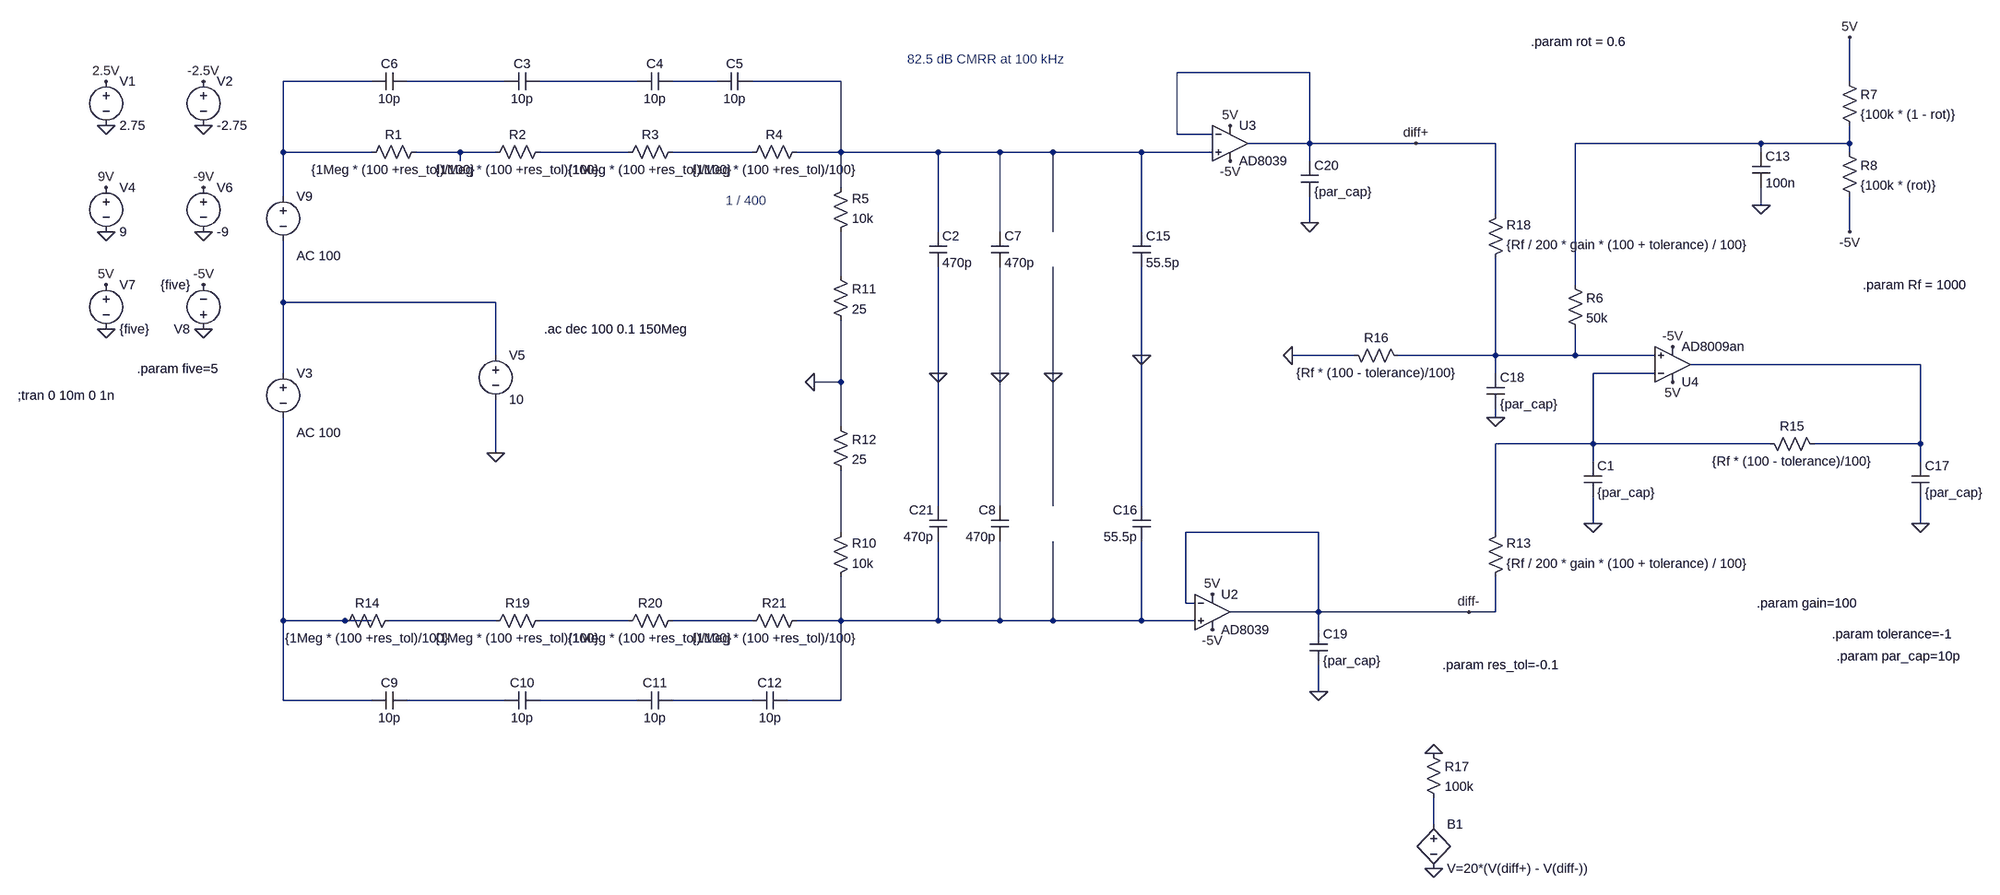
[diagram p0: schematic ac_analysis_dc_offset.asc]
ac_analysis_dc_offset.asc, the LTspice schematic file:
Version 4
SHEET 1 3776 1588
WIRE 2096 -272 1856 -272
WIRE 400 -256 240 -256
WIRE 640 -256 464 -256
WIRE 880 -256 704 -256
WIRE 1024 -256 944 -256
WIRE 1248 -256 1088 -256
WIRE 3072 -256 3072 -336
WIRE 1856 -160 1856 -272
WIRE 1920 -160 1856 -160
WIRE 2096 -144 2096 -272
WIRE 2096 -144 1984 -144
WIRE 2288 -144 2096 -144
WIRE 2432 -144 2288 -144
WIRE 2912 -144 2576 -144
WIRE 3072 -144 3072 -176
WIRE 3072 -144 2912 -144
WIRE 240 -128 240 -256
WIRE 400 -128 240 -128
WIRE 560 -128 480 -128
WIRE 624 -128 560 -128
WIRE 864 -128 704 -128
WIRE 1088 -128 944 -128
WIRE 1248 -128 1248 -256
WIRE 1248 -128 1168 -128
WIRE 1424 -128 1248 -128
WIRE 1536 -128 1424 -128
WIRE 1632 -128 1536 -128
WIRE 1792 -128 1632 -128
WIRE 1920 -128 1792 -128
WIRE 2912 -128 2912 -144
WIRE 3072 -128 3072 -144
WIRE 560 -112 560 -128
WIRE 2096 -112 2096 -144
WIRE 1248 -64 1248 -128
WIRE 240 -48 240 -128
WIRE 2912 -32 2912 -64
WIRE 2432 -16 2432 -144
WIRE 2096 0 2096 -48
WIRE 1424 16 1424 -128
WIRE 1536 16 1536 -128
WIRE 1632 16 1632 -128
WIRE 1792 16 1792 -128
WIRE 3072 16 3072 -48
WIRE 1248 96 1248 16
WIRE 2576 112 2576 -144
WIRE 240 144 240 32
WIRE 624 144 240 144
WIRE 624 240 624 144
WIRE 1792 240 1792 80
WIRE 2176 240 2064 240
WIRE 2432 240 2432 64
WIRE 2432 240 2256 240
WIRE 2576 240 2576 192
WIRE 2576 240 2432 240
WIRE 2720 240 2576 240
WIRE 3200 256 2784 256
WIRE 240 272 240 144
WIRE 1424 272 1424 80
WIRE 1536 272 1536 80
WIRE 1632 272 1632 80
WIRE 2432 272 2432 240
WIRE 2720 272 2608 272
WIRE 1248 288 1248 176
WIRE 1248 288 1200 288
WIRE 2432 352 2432 336
WIRE 1248 368 1248 288
WIRE 2608 400 2608 272
WIRE 2608 400 2432 400
WIRE 2928 400 2608 400
WIRE 3200 400 3200 256
WIRE 3200 400 3008 400
WIRE 624 416 624 320
WIRE 2608 432 2608 400
WIRE 3200 432 3200 400
WIRE 1424 512 1424 272
WIRE 1536 512 1536 272
WIRE 1632 512 1632 272
WIRE 1792 512 1792 240
WIRE 2608 544 2608 496
WIRE 3200 544 3200 496
WIRE 1248 560 1248 448
WIRE 2112 560 1872 560
WIRE 2432 560 2432 400
WIRE 1872 688 1872 560
WIRE 1888 688 1872 688
WIRE 2112 704 2112 560
WIRE 2112 704 1952 704
WIRE 2384 704 2112 704
WIRE 2432 704 2432 640
WIRE 2432 704 2384 704
WIRE 240 720 240 352
WIRE 352 720 240 720
WIRE 400 720 352 720
WIRE 624 720 432 720
WIRE 864 720 704 720
WIRE 1088 720 944 720
WIRE 1248 720 1248 640
WIRE 1248 720 1168 720
WIRE 1424 720 1424 576
WIRE 1424 720 1248 720
WIRE 1536 720 1536 576
WIRE 1536 720 1424 720
WIRE 1632 720 1632 576
WIRE 1632 720 1536 720
WIRE 1792 720 1792 576
WIRE 1792 720 1632 720
WIRE 1888 720 1792 720
WIRE 2112 736 2112 704
WIRE 2112 848 2112 800
WIRE 240 864 240 720
WIRE 400 864 240 864
WIRE 640 864 464 864
WIRE 880 864 704 864
WIRE 1088 864 944 864
WIRE 1248 864 1248 720
WIRE 1248 864 1152 864
WIRE 2320 1088 2320 1040
FLAG -80 -176 0
FLAG -80 -256 2.5V
FLAG 96 -176 0
FLAG 96 -256 -2.5V
FLAG 1200 288 0
FLAG 1632 272 0
FLAG 1792 240 0
FLAG 1952 -176 5V
FLAG 1952 -112 -5V
FLAG 624 416 0
FLAG 1536 272 0
FLAG -80 16 0
FLAG -80 -64 9V
FLAG 96 16 0
FLAG 96 -64 -9V
FLAG 2064 240 0
FLAG -80 192 0
FLAG -80 112 5V
FLAG 96 192 0
FLAG 1920 672 5V
FLAG 1920 736 -5V
FLAG 2752 288 5V
FLAG 2752 224 -5V
FLAG 96 112 -5V
FLAG 2288 -144 diff+
FLAG 2384 704 diff-
FLAG 2320 1168 0
FLAG 2320 960 0
FLAG 2432 352 0
FLAG 2608 544 0
FLAG 3200 544 0
FLAG 1424 272 0
FLAG 2112 848 0
FLAG 2096 0 0
FLAG 2912 -32 0
FLAG 3072 -336 5V
FLAG 3072 16 -5V
SYMBOL voltage -80 -272 R0
SYMATTR InstName V1
SYMATTR Value 2.75
SYMBOL voltage 96 -272 R0
SYMATTR InstName V2
SYMATTR Value -2.75
SYMBOL voltage 240 256 R0
WINDOW 123 24 124 Left 2
WINDOW 39 0 0 Left 0
SYMATTR Value2 AC 100
SYMATTR InstName V3
SYMATTR Value ""
SYMBOL res 496 -144 R90
WINDOW 0 0 56 VBottom 2
WINDOW 3 32 56 VTop 2
SYMATTR InstName R1
SYMATTR Value {1Meg * (100 +res_tol)/100}
SYMBOL res 1232 656 M180
WINDOW 0 36 76 Left 2
WINDOW 3 36 40 Left 2
SYMATTR InstName R10
SYMATTR Value 10k
SYMBOL cap 464 -272 R90
WINDOW 0 0 32 VBottom 2
WINDOW 3 32 32 VTop 2
SYMATTR InstName C6
SYMATTR Value 10p
SYMBOL cap 704 -272 R90
WINDOW 0 0 32 VBottom 2
WINDOW 3 32 32 VTop 2
SYMATTR InstName C3
SYMATTR Value 10p
SYMBOL cap 944 -272 R90
WINDOW 0 0 32 VBottom 2
WINDOW 3 32 32 VTop 2
SYMATTR InstName C4
SYMATTR Value 10p
SYMBOL cap 1088 -272 R90
WINDOW 0 0 32 VBottom 2
WINDOW 3 32 32 VTop 2
SYMATTR InstName C5
SYMATTR Value 10p
SYMBOL cap 464 848 R90
WINDOW 0 0 32 VBottom 2
WINDOW 3 32 32 VTop 2
SYMATTR InstName C9
SYMATTR Value 10p
SYMBOL cap 704 848 R90
WINDOW 0 0 32 VBottom 2
WINDOW 3 32 32 VTop 2
SYMATTR InstName C10
SYMATTR Value 10p
SYMBOL cap 944 848 R90
WINDOW 0 0 32 VBottom 2
WINDOW 3 32 32 VTop 2
SYMATTR InstName C11
SYMATTR Value 10p
SYMBOL cap 1152 848 R90
WINDOW 0 0 32 VBottom 2
WINDOW 3 32 32 VTop 2
SYMATTR InstName C12
SYMATTR Value 10p
SYMBOL cap 1776 16 R0
SYMATTR InstName C15
SYMATTR Value 55.5p
SYMBOL cap 1808 576 R180
WINDOW 0 24 56 Left 2
WINDOW 3 24 8 Left 2
SYMATTR InstName C16
SYMATTR Value 55.5p
SYMBOL res 1232 32 M180
WINDOW 0 36 76 Left 2
WINDOW 3 36 40 Left 2
SYMATTR InstName R5
SYMATTR Value 10k
SYMBOL res 2416 656 M180
WINDOW 0 36 76 Left 2
WINDOW 3 36 40 Left 2
SYMATTR InstName R13
SYMATTR Value {Rf / 200 * gain * (100 + tolerance) / 100}
SYMBOL res 2160 224 M90
WINDOW 0 0 56 VBottom 2
WINDOW 3 32 56 VTop 2
SYMATTR InstName R16
SYMATTR Value {Rf * (100 - tolerance)/100}
SYMBOL voltage 624 224 R0
WINDOW 123 0 0 Left 0
WINDOW 39 0 0 Left 0
SYMATTR InstName V5
SYMATTR Value 10
SYMBOL cap 1520 16 R0
SYMATTR InstName C7
SYMATTR Value 470p
SYMBOL cap 1552 576 R180
WINDOW 0 24 56 Left 2
WINDOW 3 24 8 Left 2
SYMATTR InstName C8
SYMATTR Value 470p
SYMBOL voltage -80 -80 R0
SYMATTR InstName V4
SYMATTR Value 9
SYMBOL voltage 96 -80 R0
SYMATTR InstName V6
SYMATTR Value -9
SYMBOL voltage -80 96 R0
SYMATTR InstName V7
SYMATTR Value {five}
SYMBOL voltage 96 208 R180
WINDOW 123 0 0 Left 0
WINDOW 39 0 0 Left 0
SYMATTR InstName V8
SYMATTR Value {five}
SYMBOL ZZZ\\OpAmp\\AD8009an 2752 256 M180
SYMATTR InstName U4
SYMBOL bv 2320 1072 R0
SYMATTR InstName B1
SYMATTR Value V=20*(V(diff+) - V(diff-))
SYMBOL res 2304 944 R0
SYMATTR InstName R17
SYMATTR Value 100k
SYMBOL cap 2416 272 R0
SYMATTR InstName C18
SYMATTR Value {par_cap}
SYMBOL res 1232 80 R0
SYMATTR InstName R11
SYMATTR Value 25
SYMBOL res 1232 352 R0
SYMATTR InstName R12
SYMATTR Value 25
SYMBOL cap 1408 16 R0
SYMATTR InstName C2
SYMATTR Value 470p
SYMBOL cap 1440 576 R180
WINDOW 0 24 56 Left 2
WINDOW 3 24 8 Left 2
SYMATTR InstName C21
SYMATTR Value 470p
SYMBOL res 2912 384 M90
WINDOW 0 0 56 VBottom 2
WINDOW 3 32 56 VTop 2
SYMATTR InstName R15
SYMATTR Value {Rf * (100 - tolerance)/100}
SYMBOL res 2416 80 M180
WINDOW 0 36 76 Left 2
WINDOW 3 36 40 Left 2
SYMATTR InstName R18
SYMATTR Value {Rf / 200 * gain * (100 + tolerance) / 100}
SYMBOL cap 3184 432 R0
SYMATTR InstName C17
SYMATTR Value {par_cap}
SYMBOL cap 2592 432 R0
SYMATTR InstName C1
SYMATTR Value {par_cap}
SYMBOL cap 2096 736 R0
SYMATTR InstName C19
SYMATTR Value {par_cap}
SYMBOL cap 2080 -112 R0
SYMATTR InstName C20
SYMATTR Value {par_cap}
SYMBOL res 720 -144 R90
WINDOW 0 0 56 VBottom 2
WINDOW 3 32 56 VTop 2
SYMATTR InstName R2
SYMATTR Value {1Meg * (100 +res_tol)/100}
SYMBOL res 960 -144 R90
WINDOW 0 0 56 VBottom 2
WINDOW 3 32 56 VTop 2
SYMATTR InstName R3
SYMATTR Value {1Meg * (100 +res_tol)/100}
SYMBOL res 1184 -144 R90
WINDOW 0 0 56 VBottom 2
WINDOW 3 32 56 VTop 2
SYMATTR InstName R4
SYMATTR Value {1Meg * (100 +res_tol)/100}
SYMBOL res 448 704 R90
WINDOW 0 0 56 VBottom 2
WINDOW 3 32 56 VTop 2
SYMATTR InstName R14
SYMATTR Value {1Meg * (100 +res_tol)/100}
SYMBOL res 720 704 R90
WINDOW 0 0 56 VBottom 2
WINDOW 3 32 56 VTop 2
SYMATTR InstName R19
SYMATTR Value {1Meg * (100 +res_tol)/100}
SYMBOL res 960 704 R90
WINDOW 0 0 56 VBottom 2
WINDOW 3 32 56 VTop 2
SYMATTR InstName R20
SYMATTR Value {1Meg * (100 +res_tol)/100}
SYMBOL res 1184 704 R90
WINDOW 0 0 56 VBottom 2
WINDOW 3 32 56 VTop 2
SYMATTR InstName R21
SYMATTR Value {1Meg * (100 +res_tol)/100}
SYMBOL voltage 240 -64 R0
WINDOW 123 24 124 Left 2
WINDOW 39 0 0 Left 0
SYMATTR Value2 AC 100
SYMATTR InstName V9
SYMATTR Value ""
SYMBOL OpAmps\\AD8039 1920 640 R0
SYMATTR InstName U2
SYMBOL OpAmps\\AD8039 1952 -208 R0
SYMATTR InstName U3
SYMBOL res 2560 96 R0
SYMATTR InstName R6
SYMATTR Value 50k
SYMBOL cap 2896 -128 R0
SYMATTR InstName C13
SYMATTR Value 100n
SYMBOL res 3056 -272 R0
SYMATTR InstName R7
SYMATTR Value {100k * (1 - rot)}
SYMBOL res 3056 -144 R0
SYMATTR InstName R8
SYMATTR Value {100k * (rot)}
TEXT -240 312 Left 2 !;tran 0 10m 0 1n
TEXT 1040 -40 Left 2 ;1 / 400
TEXT -24 264 Left 2 !.param five=5
TEXT 1368 -296 Left 2 ;82.5 dB CMRR at 100 kHz
TEXT 3040 744 Left 2 !.param tolerance=-1
TEXT 3048 784 Left 2 !.param par_cap=10p
TEXT 2336 800 Left 2 !.param res_tol=-0.1
TEXT 2904 688 Left 2 !.param gain=100
TEXT 712 192 Left 2 !.ac dec 100 0.1 150Meg
TEXT 3096 112 Left 2 !.param Rf = 1000
TEXT 2496 -328 Left 2 !.param rot = 0.6

The netlist it stands for:
* ac_analysis_dc_offset.asc
V1 2.5V 0 2.75
V2 -2.5V 0 -2.75
V3 N011 N016 AC 100
R1 N007 N001 {1Meg * (100 +res_tol)/100}
R10 N020 N015 10k
C6 N002 N001 10p
C3 N003 N002 10p
C4 N004 N003 10p
C5 N005 N004 10p
C9 N021 N016 10p
C10 N022 N021 10p
C11 N023 N022 10p
C12 N020 N023 10p
C15 N005 0 55.5p
C16 N020 0 55.5p
R5 N010 N005 10k
R13 diff- N014 {Rf / 200 * gain * (100 + tolerance) / 100}
R16 0 N012 {Rf * (100 - tolerance)/100}
V5 N011 0 10
C7 N005 0 470p
C8 N020 0 470p
V4 9V 0 9
V6 -9V 0 -9
V7 5V 0 {five}
V8 0 -5V {five}
* U4: AD8009an (symbol ZZZ\OpAmp\AD8009an not available, pins judged from their places): In+=N012 In-=N014 V+=5V V-=-5V OUT=N013
B1 N024 0 V=20*(V(diff+) - V(diff-))
R17 0 N024 100k
C18 N012 0 {par_cap}
R11 N010 0 25
R12 0 N015 25
C2 N005 0 470p
C21 N020 0 470p
R15 N014 N013 {Rf * (100 - tolerance)/100}
R18 N012 diff+ {Rf / 200 * gain * (100 + tolerance) / 100}
C17 N013 0 {par_cap}
C1 N014 0 {par_cap}
C19 diff- 0 {par_cap}
C20 diff+ 0 {par_cap}
R2 N008 N007 {1Meg * (100 +res_tol)/100}
R3 N009 N008 {1Meg * (100 +res_tol)/100}
R4 N005 N009 {1Meg * (100 +res_tol)/100}
R14 N017 N016 {1Meg * (100 +res_tol)/100}
R19 N018 N017 {1Meg * (100 +res_tol)/100}
R20 N019 N018 {1Meg * (100 +res_tol)/100}
R21 N020 N019 {1Meg * (100 +res_tol)/100}
V9 N001 N011 AC 100
XU2 N020 diff- 5V -5V diff- AD8039  ; pins In+ In- V+ V- OUT
XU3 N005 diff+ 5V -5V diff+ AD8039  ; pins In+ In- V+ V- OUT
R6 N006 N012 50k
C13 N006 0 100n
R7 5V N006 {100k * (1 - rot)}
R8 N006 -5V {100k * (rot)}
;tran 0 10m 0 1n
* 1 / 400
.param five=5
* 82.5 dB CMRR at 100 kHz
.param tolerance=-1
.param par_cap=10p
.param res_tol=-0.1
.param gain=100
.ac dec 100 0.1 150Meg
.param Rf = 1000
.param rot = 0.6
.backanno
.end